# Altium schematic sheet Reed Switches.SchDoc
size A2; SheetNumber: 2; SheetTotal: 4
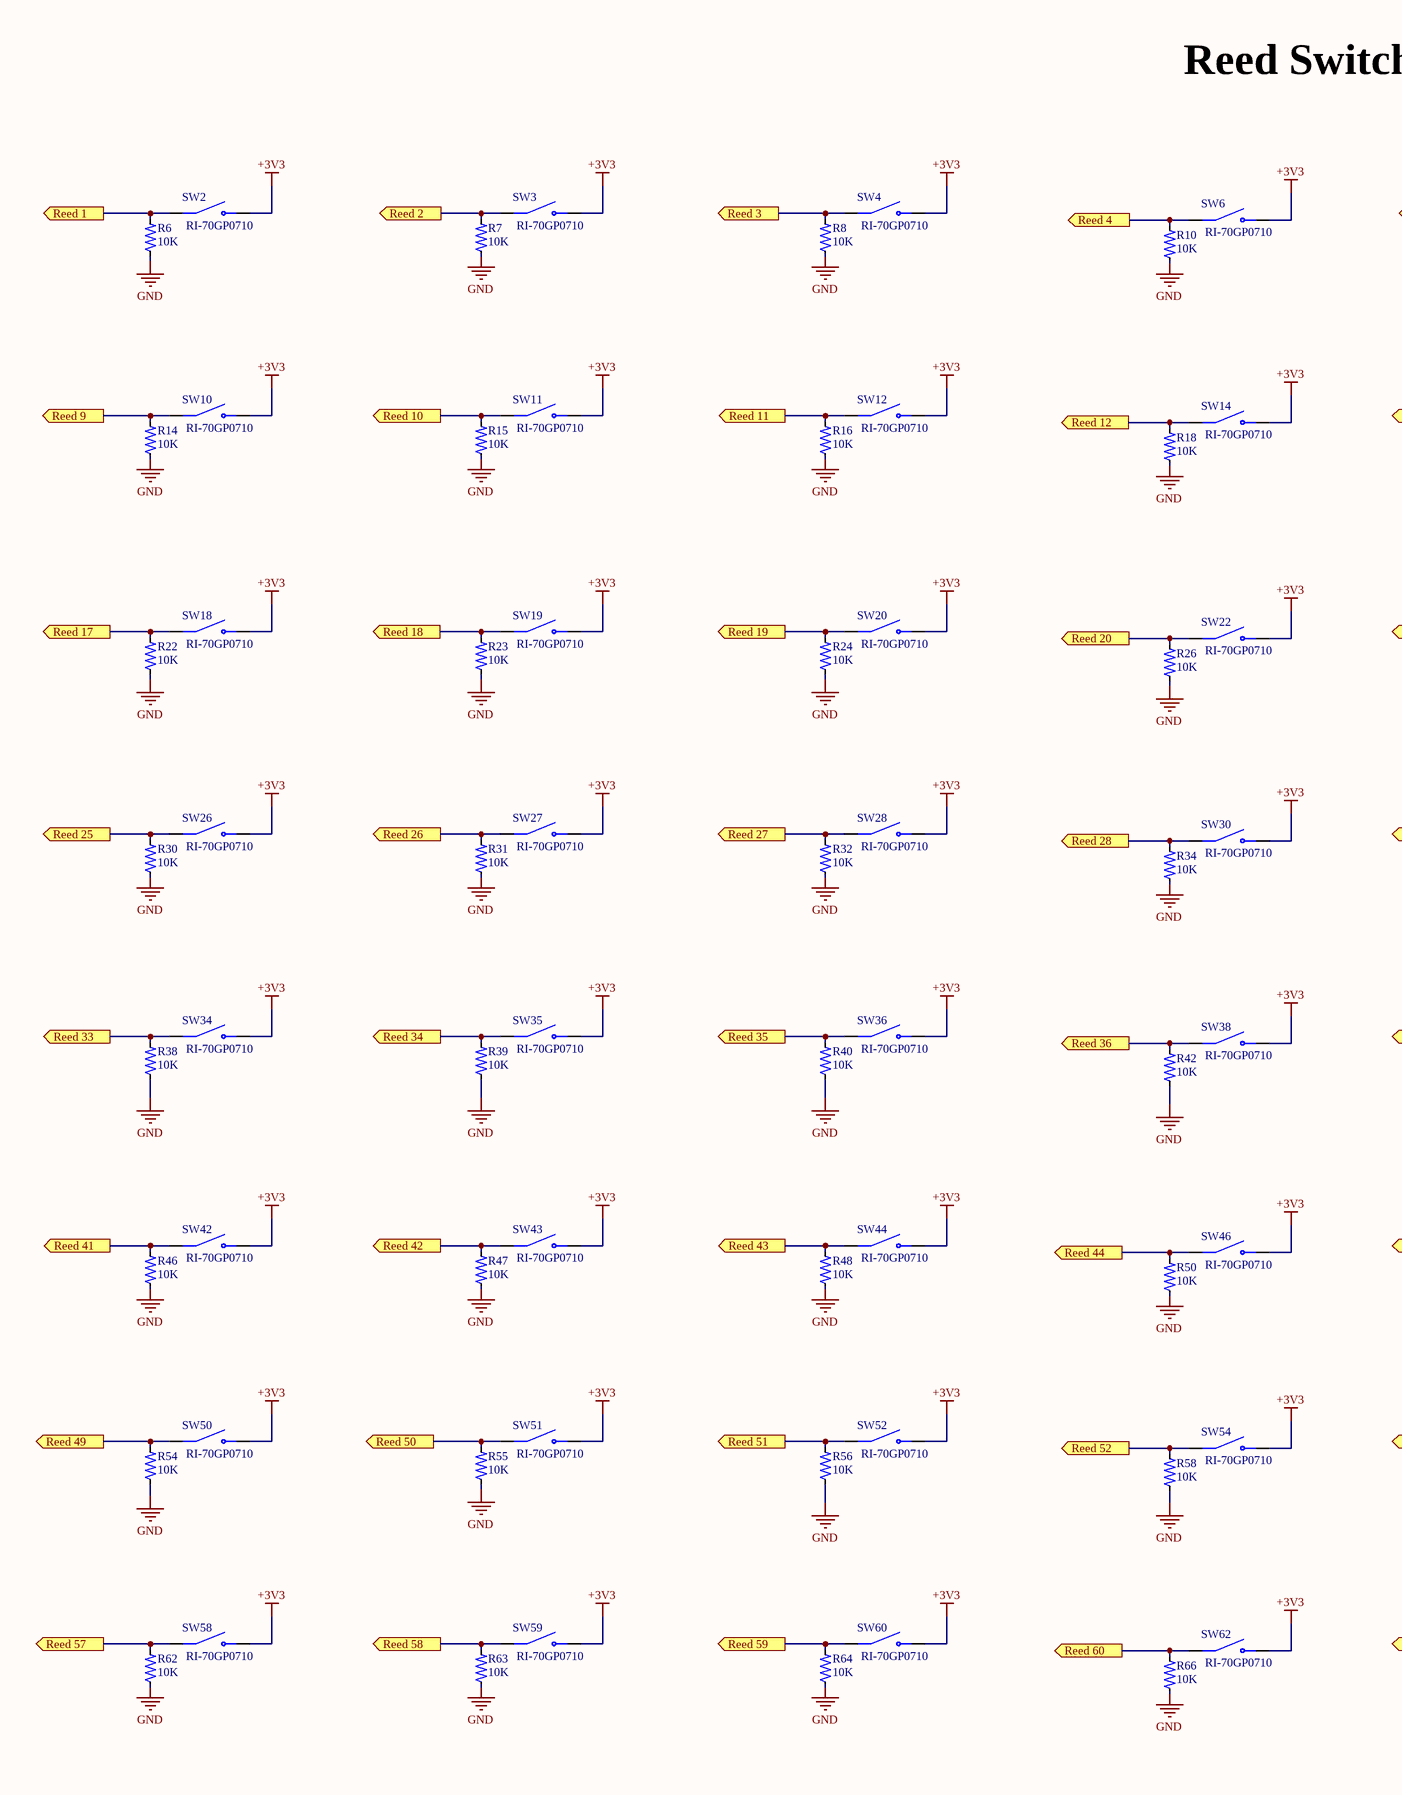
[diagram p0: Reed Switches.SchDoc, left]
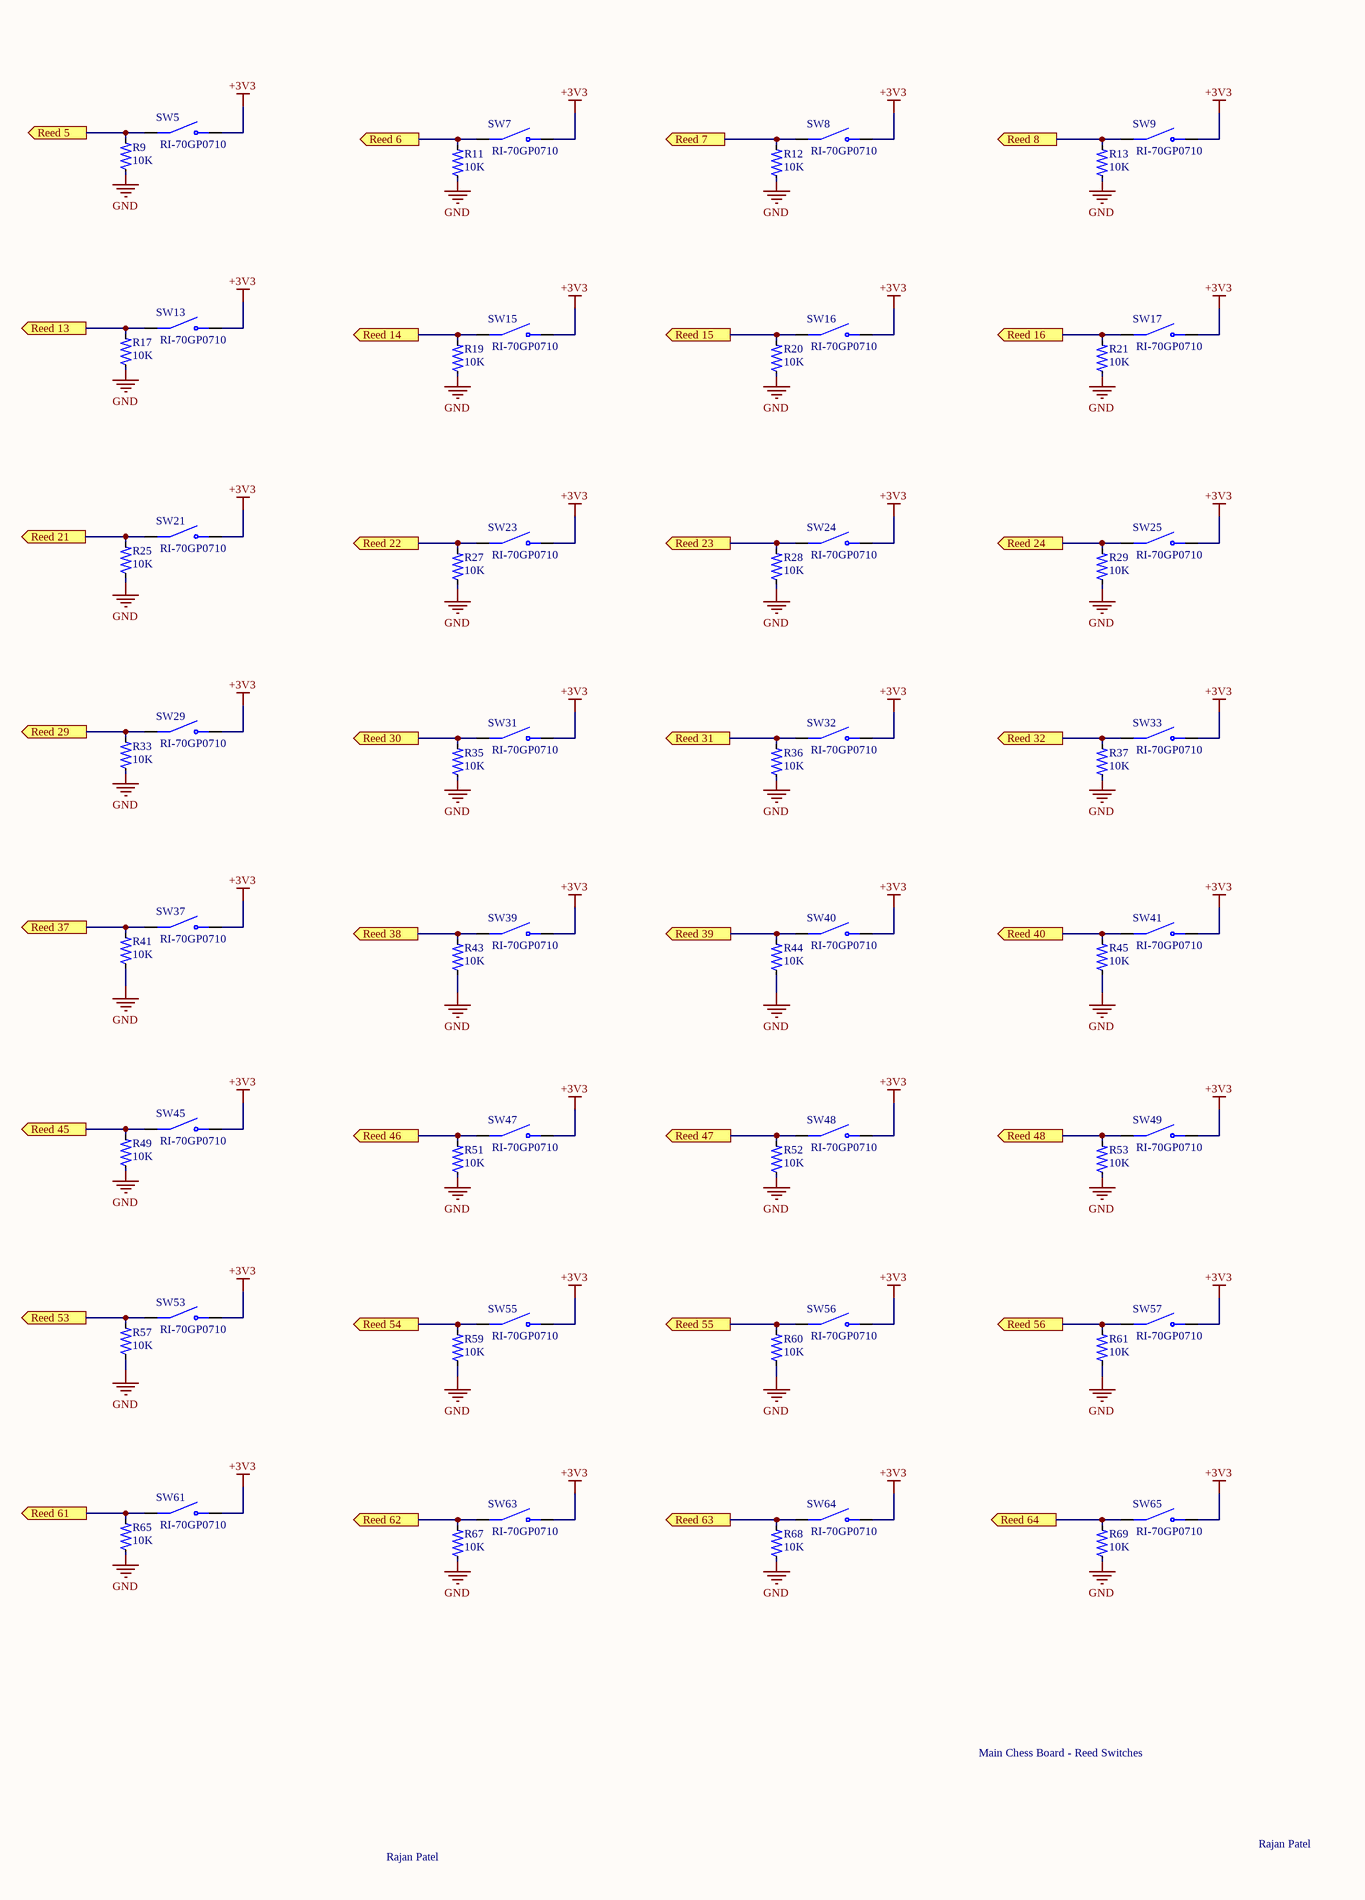
[diagram p1: Reed Switches.SchDoc, right]

## Parts
R6  10K  [res 0805]
R7  10K  [res 0805]
R8  10K  [res 0805]
R9  10K  [res 0805]
R10  10K  [res 0805]
R11  10K  [res 0805]
R12  10K  [res 0805]
R13  10K  [res 0805]
R14  10K  [res 0805]
R15  10K  [res 0805]
R16  10K  [res 0805]
R17  10K  [res 0805]
R18  10K  [res 0805]
R19  10K  [res 0805]
R20  10K  [res 0805]
R21  10K  [res 0805]
R22  10K  [res 0805]
R23  10K  [res 0805]
R24  10K  [res 0805]
R25  10K  [res 0805]
R26  10K  [res 0805]
R27  10K  [res 0805]
R28  10K  [res 0805]
R29  10K  [res 0805]
R30  10K  [res 0805]
R31  10K  [res 0805]
R32  10K  [res 0805]
R33  10K  [res 0805]
R34  10K  [res 0805]
R35  10K  [res 0805]
R36  10K  [res 0805]
R37  10K  [res 0805]
R38  10K  [res 0805]
R39  10K  [res 0805]
R40  10K  [res 0805]
R41  10K  [res 0805]
R42  10K  [res 0805]
R43  10K  [res 0805]
R44  10K  [res 0805]
R45  10K  [res 0805]
R46  10K  [res 0805]
R47  10K  [res 0805]
R48  10K  [res 0805]
R49  10K  [res 0805]
R50  10K  [res 0805]
R51  10K  [res 0805]
R52  10K  [res 0805]
R53  10K  [res 0805]
R54  10K  [res 0805]
R55  10K  [res 0805]
R56  10K  [res 0805]
R57  10K  [res 0805]
R58  10K  [res 0805]
R59  10K  [res 0805]
R60  10K  [res 0805]
R61  10K  [res 0805]
R62  10K  [res 0805]
R63  10K  [res 0805]
R64  10K  [res 0805]
R65  10K  [res 0805]
R66  10K  [res 0805]
R67  10K  [res 0805]
R68  10K  [res 0805]
R69  10K  [res 0805]
SW2  RI-70GP0710  [RI-70GP0710]
SW3  RI-70GP0710  [RI-70GP0710]
SW4  RI-70GP0710  [RI-70GP0710]
SW5  RI-70GP0710  [RI-70GP0710]
SW6  RI-70GP0710  [RI-70GP0710]
SW7  RI-70GP0710  [RI-70GP0710]
SW8  RI-70GP0710  [RI-70GP0710]
SW9  RI-70GP0710  [RI-70GP0710]
SW10  RI-70GP0710  [RI-70GP0710]
SW11  RI-70GP0710  [RI-70GP0710]
SW12  RI-70GP0710  [RI-70GP0710]
SW13  RI-70GP0710  [RI-70GP0710]
SW14  RI-70GP0710  [RI-70GP0710]
SW15  RI-70GP0710  [RI-70GP0710]
SW16  RI-70GP0710  [RI-70GP0710]
SW17  RI-70GP0710  [RI-70GP0710]
SW18  RI-70GP0710  [RI-70GP0710]
SW19  RI-70GP0710  [RI-70GP0710]
SW20  RI-70GP0710  [RI-70GP0710]
SW21  RI-70GP0710  [RI-70GP0710]
SW22  RI-70GP0710  [RI-70GP0710]
SW23  RI-70GP0710  [RI-70GP0710]
SW24  RI-70GP0710  [RI-70GP0710]
SW25  RI-70GP0710  [RI-70GP0710]
SW26  RI-70GP0710  [RI-70GP0710]
SW27  RI-70GP0710  [RI-70GP0710]
SW28  RI-70GP0710  [RI-70GP0710]
SW29  RI-70GP0710  [RI-70GP0710]
SW30  RI-70GP0710  [RI-70GP0710]
SW31  RI-70GP0710  [RI-70GP0710]
SW32  RI-70GP0710  [RI-70GP0710]
SW33  RI-70GP0710  [RI-70GP0710]
SW34  RI-70GP0710  [RI-70GP0710]
SW35  RI-70GP0710  [RI-70GP0710]
SW36  RI-70GP0710  [RI-70GP0710]
SW37  RI-70GP0710  [RI-70GP0710]
SW38  RI-70GP0710  [RI-70GP0710]
SW39  RI-70GP0710  [RI-70GP0710]
SW40  RI-70GP0710  [RI-70GP0710]
SW41  RI-70GP0710  [RI-70GP0710]
SW42  RI-70GP0710  [RI-70GP0710]
SW43  RI-70GP0710  [RI-70GP0710]
SW44  RI-70GP0710  [RI-70GP0710]
SW45  RI-70GP0710  [RI-70GP0710]
SW46  RI-70GP0710  [RI-70GP0710]
SW47  RI-70GP0710  [RI-70GP0710]
SW48  RI-70GP0710  [RI-70GP0710]
SW49  RI-70GP0710  [RI-70GP0710]
SW50  RI-70GP0710  [RI-70GP0710]
SW51  RI-70GP0710  [RI-70GP0710]
SW52  RI-70GP0710  [RI-70GP0710]
SW53  RI-70GP0710  [RI-70GP0710]
SW54  RI-70GP0710  [RI-70GP0710]
SW55  RI-70GP0710  [RI-70GP0710]
SW56  RI-70GP0710  [RI-70GP0710]
SW57  RI-70GP0710  [RI-70GP0710]
SW58  RI-70GP0710  [RI-70GP0710]
SW59  RI-70GP0710  [RI-70GP0710]
SW60  RI-70GP0710  [RI-70GP0710]
SW61  RI-70GP0710  [RI-70GP0710]
SW62  RI-70GP0710  [RI-70GP0710]
SW63  RI-70GP0710  [RI-70GP0710]
SW64  RI-70GP0710  [RI-70GP0710]
SW65  RI-70GP0710  [RI-70GP0710]

## Ports
Reed 1 (out, see Shift Registers[2B]), Reed 2 (out, see Shift Registers[2B]), Reed 3 (out, see Shift Registers[2B]), Reed 4 (out, see Shift Registers[2B]), Reed 5 (out, see Shift Registers[2B]), Reed 6 (out, see Shift Registers[2B]), Reed 7 (out, see Shift Registers[2B]), Reed 8 (out, see Shift Registers[2B]), Reed 9 (out, see Shift Registers[1B]), Reed 10 (out, see Shift Registers[1B]), Reed 11 (out, see Shift Registers[1B]), Reed 12 (out, see Shift Registers[1B]), Reed 13 (out, see Shift Registers[1B]), Reed 14 (out, see Shift Registers[1B]), Reed 15 (out, see Shift Registers[1B]), Reed 16 (out, see Shift Registers[1B]), Reed 17 (out, see Shift Registers[4B]), Reed 18 (out, see Shift Registers[4B]), Reed 19 (out, see Shift Registers[4B]), Reed 20 (out, see Shift Registers[4B]), Reed 21 (out, see Shift Registers[4B]), Reed 22 (out, see Shift Registers[4B]), Reed 23 (out, see Shift Registers[4B]), Reed 24 (out, see Shift Registers[4B]), Reed 25 (out, see Shift Registers[3B]), Reed 26 (out, see Shift Registers[3B]), Reed 27 (out, see Shift Registers[3B]), Reed 28 (out, see Shift Registers[3B]), Reed 29 (out, see Shift Registers[3B]), Reed 30 (out, see Shift Registers[3B]), Reed 31 (out, see Shift Registers[3B]), Reed 32 (out, see Shift Registers[3B]), Reed 33 (out, see Shift Registers[2C]), Reed 34 (out, see Shift Registers[2C]), Reed 35 (out, see Shift Registers[2C]), Reed 36 (out, see Shift Registers[2C]), Reed 37 (out, see Shift Registers[2C]), Reed 38 (out, see Shift Registers[2C]), Reed 39 (out, see Shift Registers[2C]), Reed 40 (out, see Shift Registers[2C]), Reed 41 (out, see Shift Registers[1C]), Reed 42 (out, see Shift Registers[1C]), Reed 43 (out, see Shift Registers[1C]), Reed 44 (out, see Shift Registers[1C]), Reed 45 (out, see Shift Registers[1C]), Reed 46 (out, see Shift Registers[1C]), Reed 47 (out, see Shift Registers[1C]), Reed 48 (out, see Shift Registers[1C]), Reed 49 (out, see Shift Registers[4C]), Reed 50 (out, see Shift Registers[4C]), Reed 51 (out, see Shift Registers[4C]), Reed 52 (out, see Shift Registers[4C]), Reed 53 (out, see Shift Registers[4C]), Reed 54 (out, see Shift Registers[4C]), Reed 55 (out, see Shift Registers[4C]), Reed 56 (out, see Shift Registers[4C]), Reed 57 (out, see Shift Registers[3C]), Reed 58 (out, see Shift Registers[3C]), Reed 59 (out, see Shift Registers[3C]), Reed 60 (out, see Shift Registers[3C]), Reed 61 (out, see Shift Registers[3C]), Reed 62 (out, see Shift Registers[3C]), Reed 63 (out, see Shift Registers[3C]), Reed 64 (out, see Shift Registers[3C])

## Nets
+3V3: SW2.2(NO) SW3.2(NO) SW4.2(NO) SW5.2(NO) SW6.2(NO) SW7.2(NO) SW8.2(NO) SW9.2(NO) SW10.2(NO) SW11.2(NO) SW12.2(NO) SW13.2(NO) SW14.2(NO) SW15.2(NO) SW16.2(NO) SW17.2(NO) SW18.2(NO) SW19.2(NO) SW20.2(NO) SW21.2(NO) SW22.2(NO) SW23.2(NO) SW24.2(NO) SW25.2(NO) SW26.2(NO) SW27.2(NO) SW28.2(NO) SW29.2(NO) SW30.2(NO) SW31.2(NO) SW32.2(NO) SW33.2(NO) SW34.2(NO) SW35.2(NO) SW36.2(NO) SW37.2(NO) SW38.2(NO) SW39.2(NO) SW40.2(NO) SW41.2(NO) SW42.2(NO) SW43.2(NO) SW44.2(NO) SW45.2(NO) SW46.2(NO) SW47.2(NO) SW48.2(NO) SW49.2(NO) SW50.2(NO) SW51.2(NO) SW52.2(NO) SW53.2(NO) SW54.2(NO) SW55.2(NO) SW56.2(NO) SW57.2(NO) SW58.2(NO) SW59.2(NO) SW60.2(NO) SW61.2(NO) SW62.2(NO) SW63.2(NO) SW64.2(NO) SW65.2(NO)
GND: R6.1 R7.1 R8.1 R9.1 R10.1 R11.1 R12.1 R13.1 R14.1 R15.1 R16.1 R17.1 R18.1 R19.1 R20.1 R21.1 R22.1 R23.1 R24.1 R25.1 R26.1 R27.1 R28.1 R29.1 R30.1 R31.1 R32.1 R33.1 R34.1 R35.1 R36.1 R37.1 R38.1 R39.1 R40.1 R41.1 R42.1 R43.1 R44.1 R45.1 R46.1 R47.1 R48.1 R49.1 R50.1 R51.1 R52.1 R53.1 R54.1 R55.1 R56.1 R57.1 R58.1 R59.1 R60.1 R61.1 R62.1 R63.1 R64.1 R65.1 R66.1 R67.1 R68.1 R69.1
Reed 1: R6.2 SW2.1(COM) ; port Reed 1
Reed 2: R7.2 SW3.1(COM) ; port Reed 2
Reed 3: R8.2 SW4.1(COM) ; port Reed 3
Reed 4: R10.2 SW6.1(COM) ; port Reed 4
Reed 5: R9.2 SW5.1(COM) ; port Reed 5
Reed 6: R11.2 SW7.1(COM) ; port Reed 6
Reed 7: R12.2 SW8.1(COM) ; port Reed 7
Reed 8: R13.2 SW9.1(COM) ; port Reed 8
Reed 9: R14.2 SW10.1(COM) ; port Reed 9
Reed 10: R15.2 SW11.1(COM) ; port Reed 10
Reed 11: R16.2 SW12.1(COM) ; port Reed 11
Reed 12: R18.2 SW14.1(COM) ; port Reed 12
Reed 13: R17.2 SW13.1(COM) ; port Reed 13
Reed 14: R19.2 SW15.1(COM) ; port Reed 14
Reed 15: R20.2 SW16.1(COM) ; port Reed 15
Reed 16: R21.2 SW17.1(COM) ; port Reed 16
Reed 17: R22.2 SW18.1(COM) ; port Reed 17
Reed 18: R23.2 SW19.1(COM) ; port Reed 18
Reed 19: R24.2 SW20.1(COM) ; port Reed 19
Reed 20: R26.2 SW22.1(COM) ; port Reed 20
Reed 21: R25.2 SW21.1(COM) ; port Reed 21
Reed 22: R27.2 SW23.1(COM) ; port Reed 22
Reed 23: R28.2 SW24.1(COM) ; port Reed 23
Reed 24: R29.2 SW25.1(COM) ; port Reed 24
Reed 25: R30.2 SW26.1(COM) ; port Reed 25
Reed 26: R31.2 SW27.1(COM) ; port Reed 26
Reed 27: R32.2 SW28.1(COM) ; port Reed 27
Reed 28: R34.2 SW30.1(COM) ; port Reed 28
Reed 29: R33.2 SW29.1(COM) ; port Reed 29
Reed 30: R35.2 SW31.1(COM) ; port Reed 30
Reed 31: R36.2 SW32.1(COM) ; port Reed 31
Reed 32: R37.2 SW33.1(COM) ; port Reed 32
Reed 33: R38.2 SW34.1(COM) ; port Reed 33
Reed 34: R39.2 SW35.1(COM) ; port Reed 34
Reed 35: R40.2 SW36.1(COM) ; port Reed 35
Reed 36: R42.2 SW38.1(COM) ; port Reed 36
Reed 37: R41.2 SW37.1(COM) ; port Reed 37
Reed 38: R43.2 SW39.1(COM) ; port Reed 38
Reed 39: R44.2 SW40.1(COM) ; port Reed 39
Reed 40: R45.2 SW41.1(COM) ; port Reed 40
Reed 41: R46.2 SW42.1(COM) ; port Reed 41
Reed 42: R47.2 SW43.1(COM) ; port Reed 42
Reed 43: R48.2 SW44.1(COM) ; port Reed 43
Reed 44: R50.2 SW46.1(COM) ; port Reed 44
Reed 45: R49.2 SW45.1(COM) ; port Reed 45
Reed 46: R51.2 SW47.1(COM) ; port Reed 46
Reed 47: R52.2 SW48.1(COM) ; port Reed 47
Reed 48: R53.2 SW49.1(COM) ; port Reed 48
Reed 49: R54.2 SW50.1(COM) ; port Reed 49
Reed 50: R55.2 SW51.1(COM) ; port Reed 50
Reed 51: R56.2 SW52.1(COM) ; port Reed 51
Reed 52: R58.2 SW54.1(COM) ; port Reed 52
Reed 53: R57.2 SW53.1(COM) ; port Reed 53
Reed 54: R59.2 SW55.1(COM) ; port Reed 54
Reed 55: R60.2 SW56.1(COM) ; port Reed 55
Reed 56: R61.2 SW57.1(COM) ; port Reed 56
Reed 57: R62.2 SW58.1(COM) ; port Reed 57
Reed 58: R63.2 SW59.1(COM) ; port Reed 58
Reed 59: R64.2 SW60.1(COM) ; port Reed 59
Reed 60: R66.2 SW62.1(COM) ; port Reed 60
Reed 61: R65.2 SW61.1(COM) ; port Reed 61
Reed 62: R67.2 SW63.1(COM) ; port Reed 62
Reed 63: R68.2 SW64.1(COM) ; port Reed 63
Reed 64: R69.2 SW65.1(COM) ; port Reed 64

## Notes on the sheet
- Reed Switches
- Main Chess Board - Reed Switches
- Rajan Patel

## Library data of the parts
R6-R69 = Resistor 0805: MP: 2-2176053-2; Resistance: .39; Power_Rating: .25 W; MF: TE Connectivity; Tolerance: 1%; Package: 0805; Value: *; SnapEDA_Link: https://www.snapeda.com/parts/2-2176053-2/TE%20Connectivity/view-part/2214511/?ref=snap; Availability: Unavailable; Price: None; EU_RoHS_Compliance: Compliant with Exemptions
SW2-SW65 = RI-70GP0710: Switch Reed Spst-no 500MA 120V; Manufacturer: Comus; Supplier: Digikey; Supplier Part Number: 1835-1025-ND; Manufacturer Part Number: RI-70GP0710; RoHS: No; Stock: 52347; Pricing: 1=1.05, 10=1.01, 25=0.9496, 100=0.8201, 250=0.7474, 500=0.69488, 2000=0.6464, 4000=0.5858, 6000=0.5454 (USD); ComponentLink1URL: https://www.comus-intl.com/wp-content/uploads/2018/10/RI-70GP.pdf?src-supplier=Digikey; ComponentLink1Description: https://www.comus-intl.com/wp-content/uploads/2018/10/RI-70GP.pdf?src-supplier=Digikey